# EAGLE schematic fMeter-preamp (EAGLE 5.07)
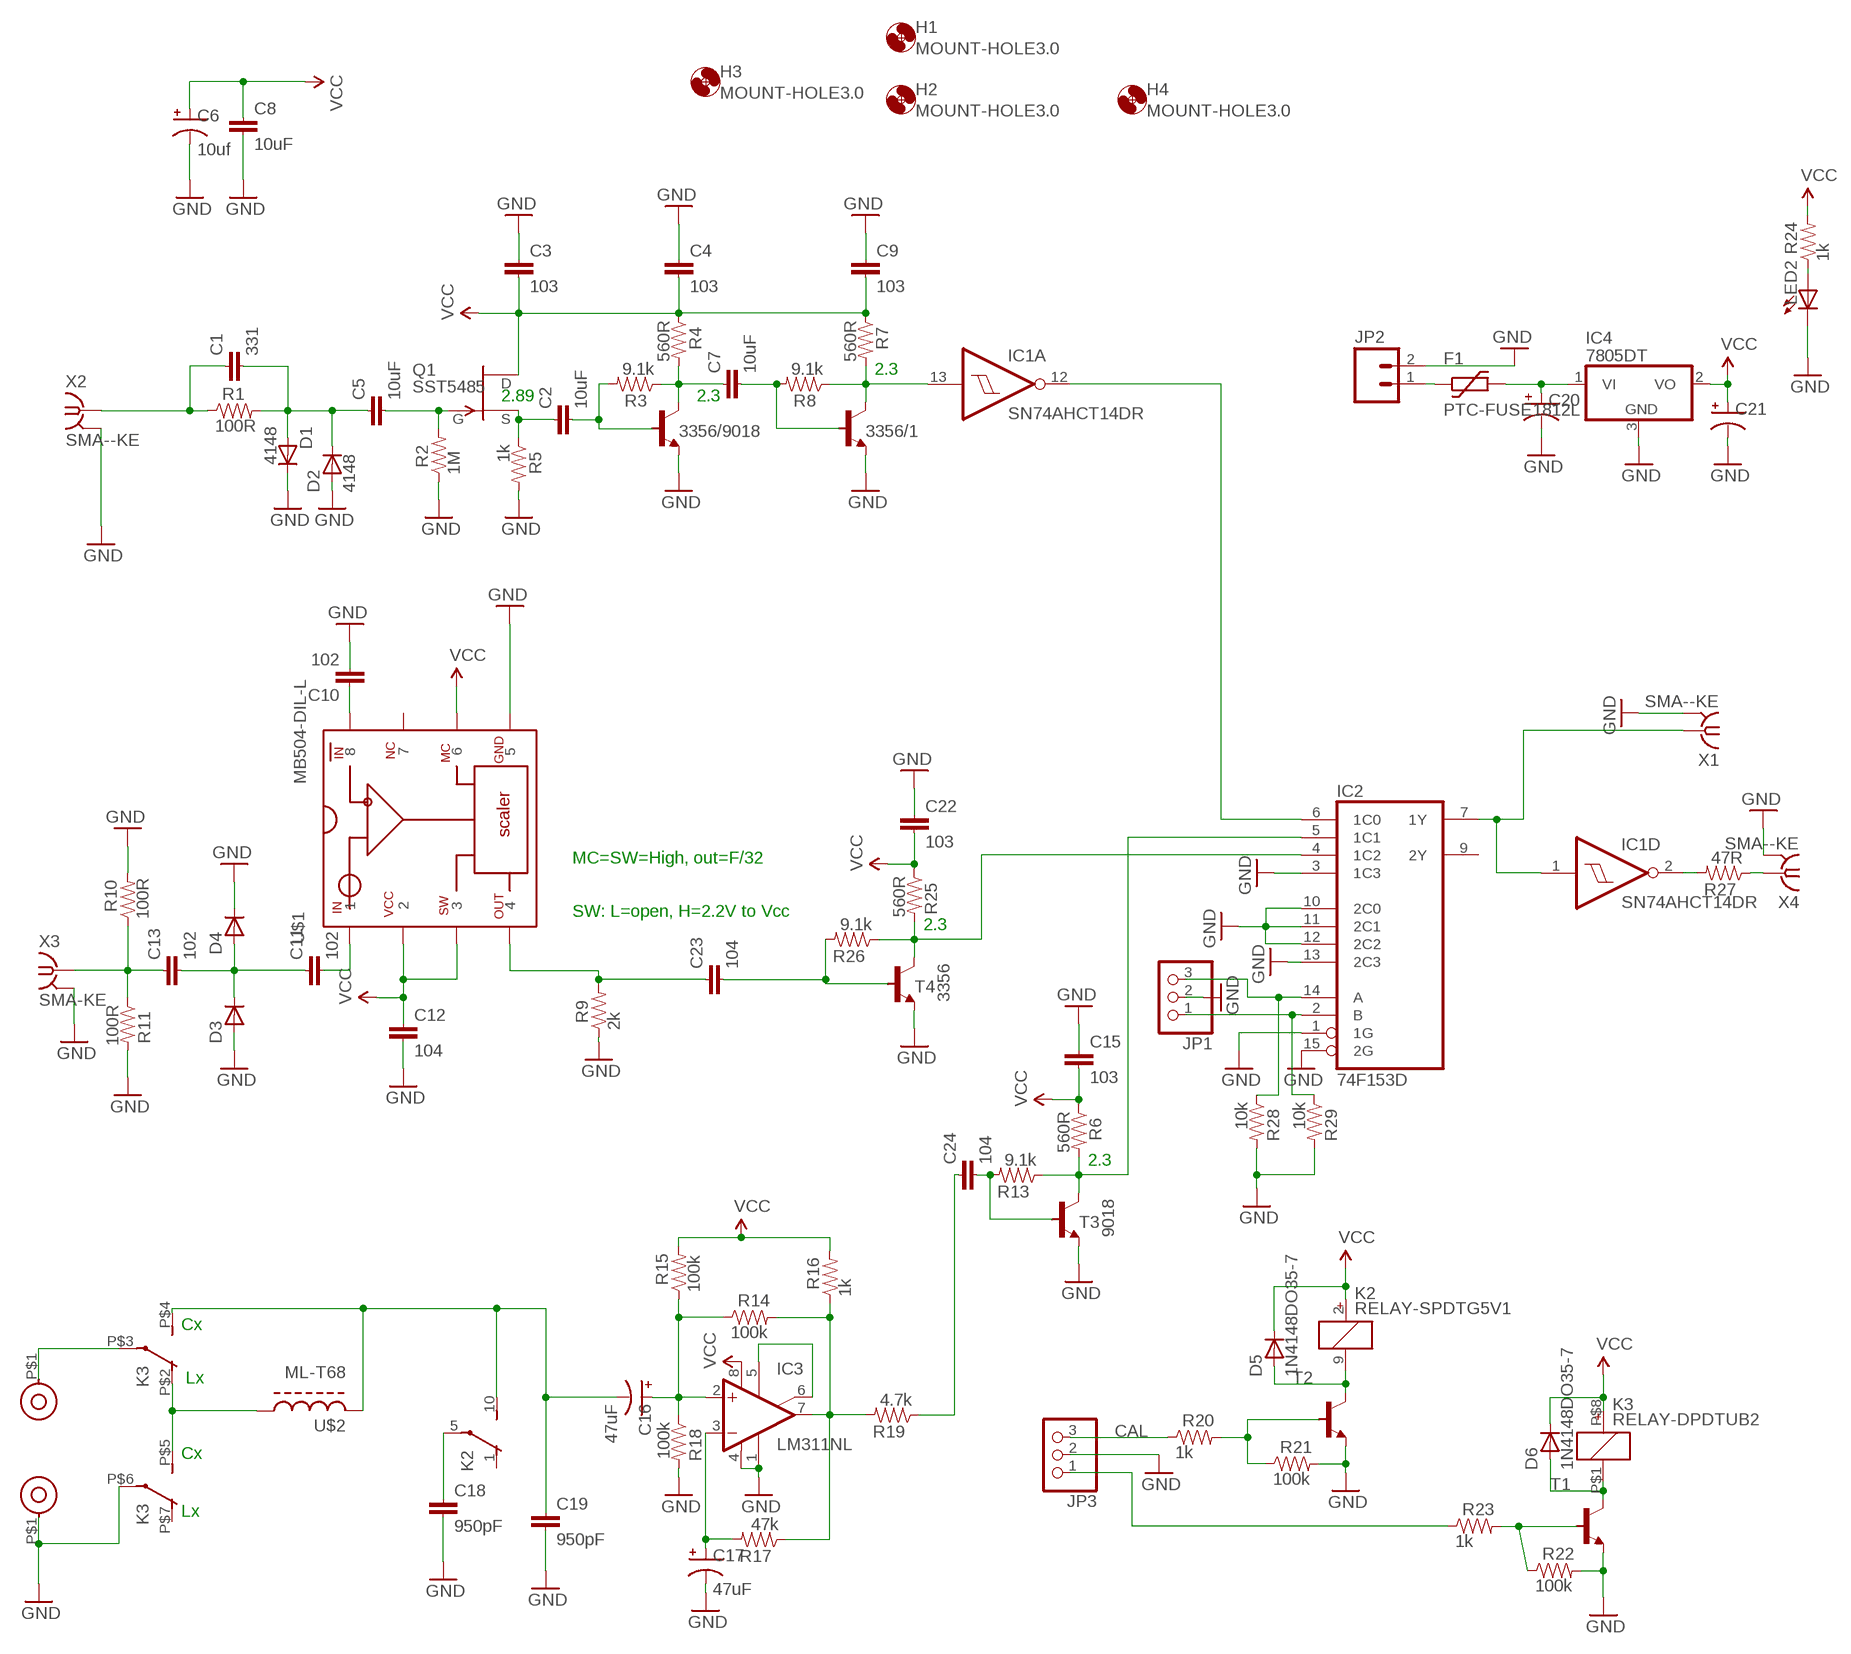
[diagram p0: schematic, sheet 1]

## Parts
3356/1  -NPN-SOT23-BEC  [SOT23-BEC]
3356/9018  -NPN-SOT23-BEC  [SOT23-BEC]
C1  331  CAP-C1206  [C1206]
C2  10uF  CAP-C1206  [C1206]
C3  103  CAP-C0805  [C0805]
C4  103  CAP-C0805  [C0805]
C5  10uF  CAP-C1206  [C1206]
C6  10uf  CAP_POL7343  [EIA7343]
C7  10uF  CAP-C0805  [C0805]
C8  10uF  CAP-C1206  [C1206]
C9  103  CAP-C0805  [C0805]
C10  102  CAP-C0805  [C0805]
C11  102  CAP-C0805  [C0805]
C12  104  CAP-C0805  [C0805]
C13  102  CAP-C0805  [C0805]
C15  103  CAP-C0805  [C0805]
C16  47uF  CAP_POL-CT6032  [CT6032]
C17  47uF  CAP_POL-CT6032  [CT6032]
C18  950pF  CAP-CB  [CB-1.3CM]
C19  950pF  CAP-CB  [CB-1.3CM]
C20  CAP_POL-CT6032  [CT6032]
C21  CAP_POL-CT6032  [CT6032]
C22  103  CAP-C0805  [C0805]
C23  104  CAP-C0805  [C0805]
C24  104  CAP-C0805  [C0805]
D1  4148  DIODE1206  [1206-DIODE]
D2  4148  DIODE1206  [1206-DIODE]
D3  DIODE1206  [1206-DIODE]
D4  DIODE1206  [1206-DIODE]
D5  1N4148DO35-7  DIODE1206  [1206-DIODE]
D6  1N4148DO35-7  DIODE1206  [1206-DIODE]
F1  PTC-FUSE1812L  [1812L]
H1  MOUNT-HOLE3.0  [3,0]
H2  MOUNT-HOLE3.0  [3,0]
H3  MOUNT-HOLE3.0  [3,0]
H4  MOUNT-HOLE3.0  [3,0]
IC1  SN74AHCT14DR  74HC14D  [SO14]
IC2  74F153D  74HC153D  [SO16]
IC3  LM311NL  [DIL-08]
IC4  7805DT  [TO252]
JP1  PINHD-1X3PTH  [1X03]
JP2  CON-02XH-V  [XH-1X2-LONG-LOCK-V]
JP3  PINHD-1X3PTH  [1X03]
K2  RELAY-SPDTG5V1  [G5V1]
K3  RELAY-DPDTUB2  [UB2-NU]
LED2  LED0805  [CHIPLED_0805]
Q1  SST5485  [SOT23]
R1  100R  RESISTOR-R0805W  [R0805W]
R2  1M  RESISTOR-R0805W  [R0805W]
R3  9.1k  RESISTOR0805  [0805]
R4  560R  RESISTOR-R0805W  [R0805W]
R5  1k  RESISTOR-R0805W  [R0805W]
R6  560R  RESISTOR-R0805W  [R0805W]
R7  560R  RESISTOR-R0805W  [R0805W]
R8  9.1k  RESISTOR-R0805W  [R0805W]
R9  2k  RESISTOR0805  [0805]
R10  100R  RESISTOR0805  [0805]
R11  100R  RESISTOR0805  [0805]
R13  9.1k  RESISTOR-R0805W  [R0805W]
R14  100k  RESISTOR-R0805W  [R0805W]
R15  100k  RESISTOR-R0805W  [R0805W]
R16  1k  RESISTOR-R0805W  [R0805W]
R17  47k  RESISTOR-R0805W  [R0805W]
R18  100k  RESISTOR-R0805W  [R0805W]
R19  4.7k  RESISTOR-R0805W  [R0805W]
R20  1k  RESISTOR-R0805W  [R0805W]
R21  100k  RESISTOR-R0805W  [R0805W]
R22  100k  RESISTOR-R0805W  [R0805W]
R23  1k  RESISTOR-R0805W  [R0805W]
R24  1k  RESISTOR-R0805W  [R0805W]
R25  560R  RESISTOR-R0805W  [R0805W]
R26  9.1k  RESISTOR-R0805W  [R0805W]
R27  47R  RESISTOR-R0805W  [R0805W]
R28  10k  RESISTOR-R0805W  [R0805W]
R29  10k  RESISTOR-R0805W  [R0805W]
T1  -NPN-SOT23-BEC  [SOT23-BEC]
T2  -NPN-SOT23-BEC  [SOT23-BEC]
T3  9018  -NPN-SOT23-BEC  [SOT23-BEC]
T4  3356  -NPN-SOT23-BEC  [SOT23-BEC]
U$1  MB504-DIL-L  [DIP08-L]
U$2  ML-T68  [T68-PIN2]
U$3  SOCK  [SOCK-5MM]
U$4  SOCK  [SOCK-5MM]
X1  SMA--KE  [SMA-KE]
X2  SMA--KE  [SMA-KE]
X3  SMA-KE  SMA-142-0711-821/826  [J502-ND-142-0711-821/826]
X4  SMA--KE  [SMA-KE]

## Nets
CAL: JP3.3 R20.1
GND: 3356/1.E 3356/9018.E C3.1 C4.1 C6.C(-) C8.2 C9.1 C10.2 C12.2 C15.1 C17.- C18.2 C19.2 C20.- C21.- C22.1 D1.K(C) D2.A D3.A D4.K(C) IC2.1(1G) IC2.3(1C3) IC2.10(2C0) IC2.11(2C1) IC2.12(2C2) IC2.13(2C3) IC2.15(2G) IC3.1(GND) IC3.4(V-) IC4.3(GND) JP1.2 JP2.2 JP3.2 K3.P$6(-2:P) LED2.C R2.1 R5.2 R9.1 R10.2 R11.2 R18.2 R21.2 R22.2 R28.2 R29.2 T1.E T2.E T3.E T4.E U$1.5 U$3.P$1 X1.G@1(GND) X2.G@1(GND) X3.G@1(GND) X4.G@1(GND)
N$1: C1.1 R1.1 X2.1
N$2: C1.2 C5.1 D1.A D2.K(C) R1.2
N$3: C2.1 Q1.2(S) R5.1
N$4: 3356/9018.B C2.2 R3.2
N$5: 3356/9018.C C7.1 R3.1 R4.2
N$6: C5.2 Q1.3(G) R2.2
N$7: 3356/1.C IC1.13(A:I) R7.2 R8.1
N$8: IC1.1(D:I) IC2.7(1Y) X1.1
N$9: 3356/1.B C7.2 R8.2
N$10: C10.1 U$1.8
N$11: C11.2 U$1.1
N$12: C11.1 C13.2 D3.K(C) D4.A
N$13: IC1.12(A:O) IC2.6(1C0)
N$14: C13.1 R10.1 R11.1 X3.1
N$15: C16.+ IC3.2(+IN) R14.1 R15.1 R18.1
N$16: IC3.7(OUT) R14.2 R16.1 R17.1 R19.2
N$17: IC3.5(ON) IC3.6(ON/STR)
N$18: C17.+ IC3.3(-IN) R17.2
N$19: C16.- C19.1 K2.10(2:S) K3.P$4(-1:S) U$2.4
N$20: IC1.2(D:O) R27.2
N$22: C18.1 K2.5(2:P)
N$23: D5.A K2.9 T2.C
N$24: R20.2 R21.1 T2.B
N$25: K3.P$3(-1:P) U$4.P$1
N$26: K3.P$2(-1:O) K3.P$5(-2:S) U$2.3
N$27: D6.A K3.P$1 T1.C
N$28: IC2.2(B) JP1.1 R29.1
N$29: C20.+ F1.P$2 IC4.1(VI)
N$30: R22.1 R23.2 T1.B
N$31: JP3.1 R23.1
N$32: C24.2 R13.2 T3.B
N$33: F1.P$1 JP2.1
N$34: LED2.A R24.1
N$35: IC2.5(1C1) R6.2 R13.1 T3.C
N$36: C23.1 R9.2 U$1.4
N$37: IC2.4(1C2) R25.2 R26.1 T4.C
N$38: C23.2 R26.2 T4.B
N$39: C24.1 R19.1
N$40: IC2.14(A) JP1.3 R28.1
N$41: R27.1 X4.1
VCC: C3.2 C4.2 C6.A(+) C8.1 C9.2 C12.1 C15.2 C21.+ C22.2 D5.K(C) D6.K(C) IC3.8(V+) IC4.2(VO) K2.2 K3.P$8 Q1.1(D) R4.1 R6.1 R7.1 R15.2 R16.2 R24.2 R25.1 U$1.2 U$1.3 U$1.6
Unconnected: IC1.3(E:I) IC1.4(E:O) IC1.5(F:I) IC1.6(F:O) IC1.8(C:O) IC1.9(C:I) IC1.10(B:O) IC1.11(B:I) IC2.9(2Y) K2.1(2:O) K3.P$7(-2:O) U$1.7

## Notes on the sheet
- 2.3
- 2.89 | 2.3
- MC=SW=High, out=F/32
- SW: L=open, H=2.2V to Vcc
- 2.3
- 2.3
- Cx
- Lx
- Cx
- Lx

## Power pins joined to a net without a drawn wire
GND: IC1.7(P:GND) IC2.8(GND) X1.G@2(GND) X1.G@3(GND) X1.G@4(GND) X2.G@2(GND) X2.G@3(GND) X2.G@4(GND) X3.G@2(GND) X3.G@3(GND) X3.G@4(GND) X4.G@2(GND) X4.G@3(GND) X4.G@4(GND)
VCC: IC1.14(P:VCC) IC2.16(VCC)

## Library data of the parts
3356/1 3356/9018 T1-T4 = digital-toy:*-NPN-: NPN Transistror most of sot-23 use the pacages sot23-BEC, top C, left B, right E. by hyl, digital-toy. and to-92 use ebc(from-top) by hyl, digital-toy.
C1-C5 C7-C13 C15 C18 C19 C22-C24 = digital-toy:CAP: Capacitor Standard 0603 ceramic capacitor, and 0.1" leaded capacitor.
C6 C16 C17 C20 C21 = digital-toy:CAP_POL: Capacitor Polarized These are standard SMD and PTH capacitors. Normally 10uF, 47uF, and 100uF in electrolytic and tantalum varieties. Always verify the external diameter of the through hole cap, it varies with capacity, voltage, and manufacturer. The EIA devices should be standard. PANASONIC_D size: 6.5mmx6.5mmx5.5mm, 100uf (taobao:6.3mmx5.5mm), same as CVL0605 153cvl0405 size: 4mmx4mmx5.5mm, 10uf (taobao:4mmx5.5mm) ct6032 typical 47uF Tantalum, comment by hyl.
D1-D6 = digital-toy:DIODE: Diode These are standard reverse protection diodes and small signal diodes. SMA package can handle up to about 1A. SOD-323 can handle about 200mA. What the SOD-323 package when ordering, there are some mfgs out there that are 5-pin packages.
F1 = digital-toy:PTC-FUSE
H1-H4 = holes:MOUNT-HOLE: MOUNTING HOLE with drill center marker
IC1 = 74xx-eu:74*14: Hex schmitt trigger INVERTER
IC2 = 74xx-eu:74*153: Dual 4-line to 1-line data SELECTOR/MULTIPLEXER
IC3 = digital-toy:LM311: COMPARATOR
IC4 = linear:78*: Positive VOLTAGE REGULATOR Source: http://cache.national.com/ds/LM/LM78L05.pdf http://www.fairchildsemi.com/ds/LM/LM7805.pdf
JP1 JP3 = digital-toy:PINHD-1X3: PIN HEADER
JP2 = digital-toy:CON-02: Header 2 Standard 2-pin 0.1" header. Use with straight break away headers (SKU : PRT-00116), right angle break away headers (PRT-00553), swiss pins (PRT-00743), machine pins (PRT-00117), and female headers (PRT-00115). Molex polarized connector foot print use with SKU : PRT-08233 with associated crimp pins and housings.
K2 = digital-toy:RELAY-SPDT: Miniature Power PCB Relay SCHRACK 1pole 10 A Source: http://www.schrack.com/.. 5847.pdf
K3 = digital-toy:RELAY-DPDT: Note NEC coil has polarity KLEIN RELAIS WASCHDICHT 2 Wechsler Distriibutor: Conrad Electronic, Bestell Nr.: 505226-13 - 24V 505226-13 - 5V 505170-13 - 12V 505170-13 - 48V Bestar Electric Ltd. Source: http://www2.produktinfo.conrad.com/datenblaetter/500000-524999/505226-da-01-en-Kleinrelais_waschdicht_24V.pdf
LED2 = digital-toy:LED: LEDs Standard schematic elements and footprints for 5mm, 3mm, 1206, and 0603 sized LEDs. 5mm - Spark Fun Electronics SKU : COM-00529 (and others) copy led.lbr 0805 led here, by hyl digital-toy. 2010.6.29
Q1 = transistor-fet:?548*: N-Channel JFETs Source: VISHAY 2N5484.pdf Compatible: TO92 2N5245 J304 J305 U310 J308 J309 J310 TO72 2N4416 2N4416A 2N3823 2N4351 3N169 3N170 3N171 MFE3002 TO18 2N3796 2N3797 MFE825 Source: Motorola European Master Guide Pacge 3-59
R1-R11 R13-R29 = digital-toy:RESISTOR: Resistor Basic schematic elements and footprints for 0603, 1206, and PTH 1/10th watt (small) resistors. digital-toy copy vertical mount of axial-0.3 from rcl.lbr : the 0207/xx 3W resistor: 0617/17, 0617/22, 0617V
U$1 = dtoy-RF:MB504: MB501/504 by hyl 2011.4.8
U$2 = dtoy-RF:ML
U$3 U$4 = digital-toy:SOCK
X1 X2 X4 = dtoy-RF:SMA-: SMA 50 Ohm End Launch Jack Receptacle - Round Contact Johnson Components Source: www.johnsoncomponents.com .. J502-ND.pdf
X3 = con-coax:SMA-: SMA 50 Ohm End Launch Jack Receptacle - Round Contact Johnson Components Source: www.johnsoncomponents.com .. J502-ND.pdf